# EAGLE design hematicComputer (EAGLE 9.6.2)
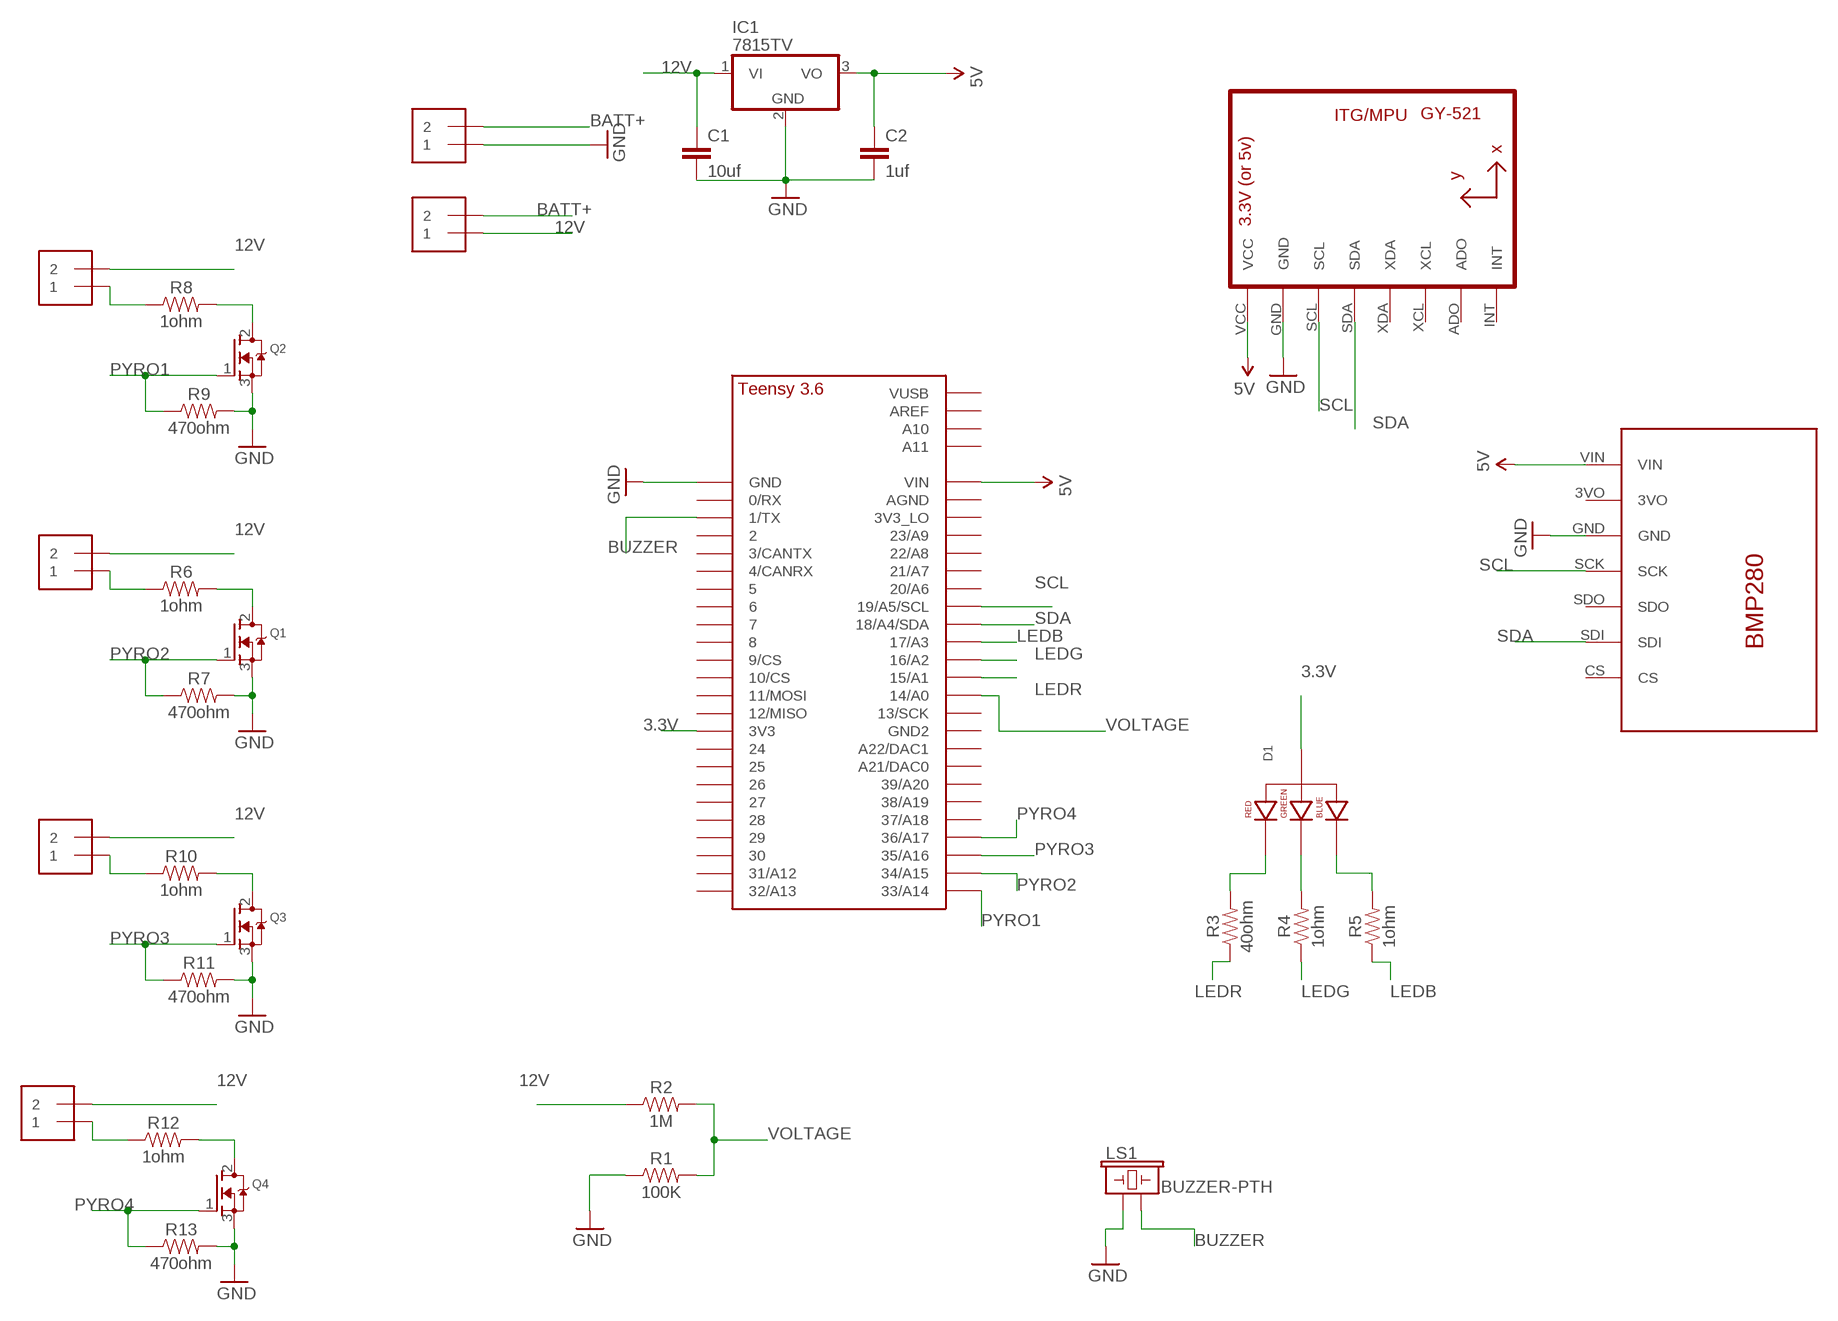
[diagram p0: schematic, sheet 1]

## Parts
C1  10uf  22PF-PTH-2.54MM-200V-5%  [CAP-PTH-2.54]
C2  1uf  22PF-PTH-2.54MM-200V-5%  [CAP-PTH-2.54]
D1  LED-RGB-CA-THRUCLEAR  [LED-RGB-THRU]
IC1  7815TV  [TO220V]
J1  1X2-3.5MM  [1X2-3.5MM]
J2  1X2-3.5MM  [1X2-3.5MM]
J3  1X2-3.5MM  [1X2-3.5MM]
J4  1X2-3.5MM  [1X2-3.5MM]
J5  1X2-3.5MM  [1X2-3.5MM]
J6  1X2-3.5MM  [1X2-3.5MM]
LS1  BUZZER-PTH  [BUZZER-12MM]
Q1  MOSFET-NGDS_TO220V  [TO220V]
Q2  MOSFET-NGDS_TO220V  [TO220V]
Q3  MOSFET-NGDS_TO220V  [TO220V]
Q4  MOSFET-NGDS_TO220V  [TO220V]
R1  100K  10KOHM-HORIZ-1/4W-1%  [AXIAL-0.3]
R2  1M  10KOHM-HORIZ-1/4W-1%  [AXIAL-0.3]
R3  40ohm  10KOHM-HORIZ-1/4W-1%  [AXIAL-0.3]
R4  1ohm  10KOHM-HORIZ-1/4W-1%  [AXIAL-0.3]
R5  1ohm  10KOHM-HORIZ-1/4W-1%  [AXIAL-0.3]
R6  1ohm  10KOHM-HORIZ-1/4W-1%  [AXIAL-0.3]
R7  470ohm  10KOHM-HORIZ-1/4W-1%  [AXIAL-0.3]
R8  1ohm  10KOHM-HORIZ-1/4W-1%  [AXIAL-0.3]
R9  470ohm  10KOHM-HORIZ-1/4W-1%  [AXIAL-0.3]
R10  1ohm  10KOHM-HORIZ-1/4W-1%  [AXIAL-0.3]
R11  470ohm  10KOHM-HORIZ-1/4W-1%  [AXIAL-0.3]
R12  1ohm  10KOHM-HORIZ-1/4W-1%  [AXIAL-0.3]
R13  470ohm  10KOHM-HORIZ-1/4W-1%  [AXIAL-0.3]
U1  GY-521MPU6050  [GY-521]
U$1  TEENSY_3.5/3.6_BASIC  [TEENSY_3.5/3.6_BASIC]
U$2  BMP280  [BMP280]

## Nets
3.3V: D1.2(ANODE) U$1.3V3
5V: C2.1 IC1.3(VO) U1.VCC U$1.VIN U$2.VIN
12V: C1.1 IC1.1(VI) J2.1 J3.2 J4.2 J5.2 J6.2 R2.P$1
BATT+: J1.2 J2.2
BUZZER: LS1.- U$1.1/TX
GND: C1.2 C2.2 IC1.2(GND) J1.1 LS1.+ Q1.3(S) Q2.3(S) Q3.3(S) Q4.3(S) R1.P$1 R7.P$2 R9.P$2 R11.P$2 R13.P$2 U1.GND U$1.GND U$2.GND
LEDB: R5.P$1 U$1.17/A3
LEDG: R4.P$1 U$1.16/A2
LEDR: R3.P$1 U$1.15/A1
N$1: D1.1(RED_CATHODE) R3.P$2
N$2: D1.3(GREEN_CATHODE) R4.P$2
N$3: D1.4(BLUE_CATHODE) R5.P$2
N$4: Q1.2(D) R6.P$2
N$5: J6.1 R6.P$1
N$7: J3.1 R8.P$1
N$8: Q2.2(D) R8.P$2
N$10: J4.1 R10.P$1
N$11: Q3.2(D) R10.P$2
N$13: J5.1 R12.P$1
N$14: Q4.2(D) R12.P$2
PYRO1: Q2.1(G) R9.P$1 U$1.33/A14
PYRO2: Q1.1(G) R7.P$1 U$1.34/A15
PYRO3: Q3.1(G) R11.P$1 U$1.35/A16
PYRO4: Q4.1(G) R13.P$1 U$1.36/A17
SCL: U1.SCL U$1.19/A5/SCL U$2.SCK
SDA: U1.SDA U$1.18/A4/SDA U$2.SDI
VOLTAGE: R1.P$2 R2.P$2 U$1.14/A0
Unconnected: U1.ADO U1.INT U1.XCL U1.XDA U$1.0/RX U$1.2 U$1.3/CANTX U$1.3V3_LO U$1.4/CANRX U$1.5 U$1.6 U$1.7 U$1.8 U$1.9/CS U$1.10/CS U$1.11/MOSI U$1.12/MISO U$1.13/SCK U$1.20/A6 U$1.21/A7 U$1.21/DAC0(A21/DAC0) U$1.22/A8 U$1.23/A9 U$1.24 U$1.25 U$1.26 U$1.27 U$1.28 U$1.29 U$1.30 U$1.31/A12 U$1.32/A13 U$1.37/A18 U$1.38/A19 U$1.39/A20 U$1.A10 U$1.A11 U$1.A22/DAC1 U$1.AGND U$1.AREF U$1.GND2 U$1.VUSB U$2.3VO U$2.CS U$2.SDO

## Library data of the parts
C1 C2 = SparkFun-Capacitors:22PF: 22pF ceramic capacitors A capacitor is a passive two-terminal electrical component used to store electrical energy temporarily in an electric field.; PROD_ID: CAP-09128; VALUE: 22pF
D1 = SparkFun-LED:LED-RGB-CA-THRU: RGB Through-hole common anode SparkFun store front COM-10821 (diffuse) COM-10820 (clear); PROD_ID: DIO-10631
IC1 = linear:78*: Positive VOLTAGE REGULATOR Source: http://cache.national.com/ds/LM/LM78L05.pdf http://www.fairchildsemi.com/ds/LM/LM7805.pdf
J1-J6 = adafruit:1X2: 3.5mm Terminal block http://www.ladyada.net/library/pcb/eaglelibrary.html
LS1 = SparkFun-Electromechanical:BUZZER: Buzzer Small round buzzers that operate around the audible 2kHz range. You can use these as speakers to create simple music or user interfaces. Variant Overview: PTH - Mini Speaker - PC Mount 12mm 2.048kHz <https://www.sparkfun.com/products/7950> PTH_KIT - Mini Speaker - PC Mount 12mm 2.048kHz <https://www.sparkfun.com/products/7950> KIT simplifies soldering by adding stop mask to one side of the pads. PTH_NO_SILK - Mini Speaker - PC Mount 12mm 2.048kHz <https://www.sparkfun.com/products/7950> No silkscreen indicator of buzzer outline. PTH_KIT_NO_SILK - Mini Speaker - PC Mount 12mm 2.048kHz <https://www.sparkfun.com/products/7950> KIT package w/o silkscreen SMD - Buzzer Audio Magnetic (CCV-084B16) SMD buzzer used on, e.g. the LilyPad Buzzer <https://www.sparkfun.com/products/8463> and RFID USB Reader <https://www.sparkfun.com/products/9963>. SMD_KIT - Buzzer Audio Magnetic (CCV-084B16) SMD Buzzer with elongated pins to make soldering easier. Used on the SparkFun Simon Says - Surface Mount Soldering Kit <https://www.sparkfun.com/products/10935>. SMD-SQUARE - Buzzer Audio Magnetic (COMP-15701) SMT square buzzer with one chamfered corner.; PROD_ID: COMP-08253; SF_SKU: COM-07950
Q1-Q4 = adafruit:MOSFET-N: N-Channel Mosfet 2N7002E - 60V 260mA SOT23 [Digikey: 2N7002ET1GOSTR-ND] - REEL BSH103 - 30V 850mA SOT23 [Digikey: 568-5013-1-ND]
R1-R13 = SparkFun-Resistors:10KOHM: 10kΩ resistor A resistor is a passive two-terminal electrical component that implements electrical resistance as a circuit element. Resistors act to reduce current flow, and, at the same time, act to lower voltage levels within circuits. - Wikipedia; PROD_ID: RES-12183; VALUE: 10k
U1 = gy-521:GY-521
U$1 = Teensy356:TEENSY_3.5/3.6_BASIC
U$2 = BMP280:BMP280

## Board
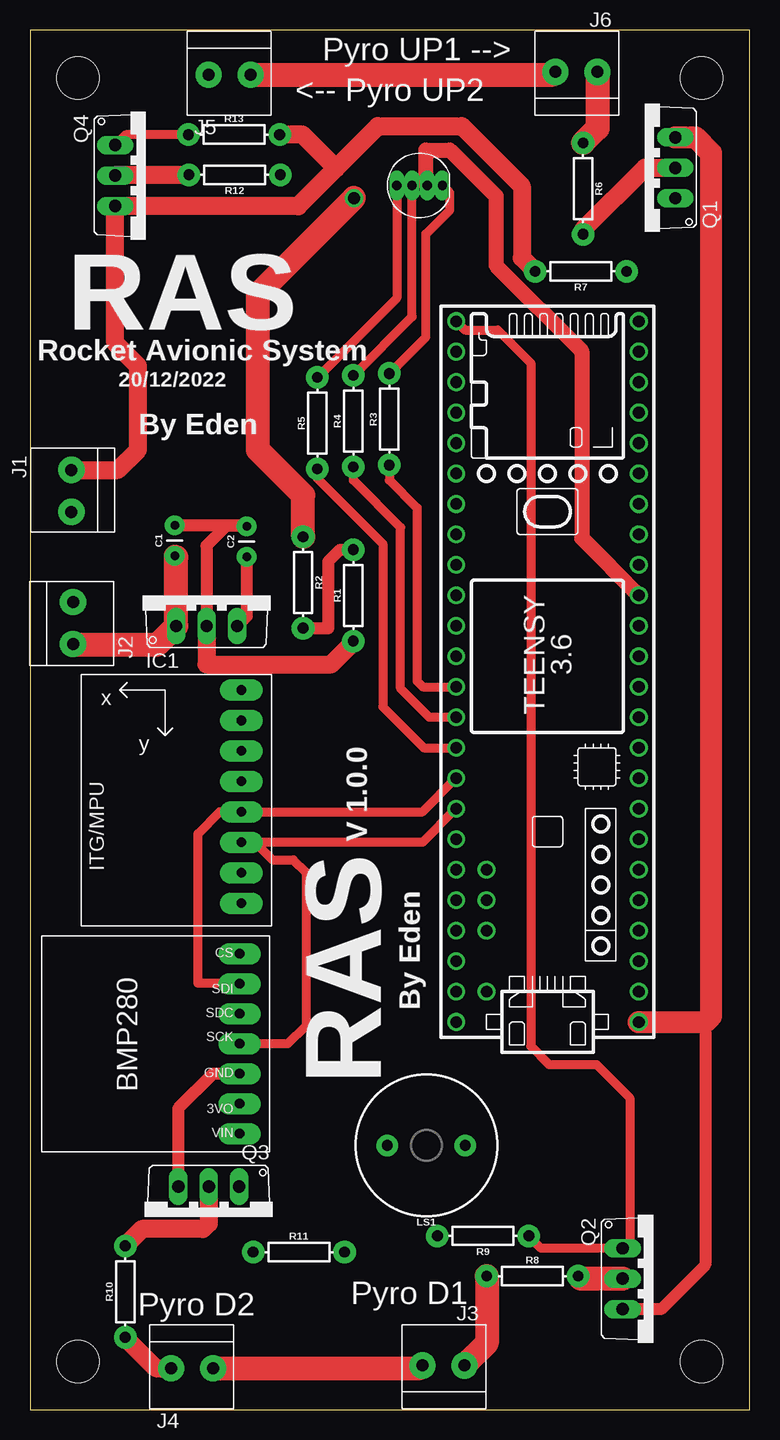
[diagram p1: board, top side]
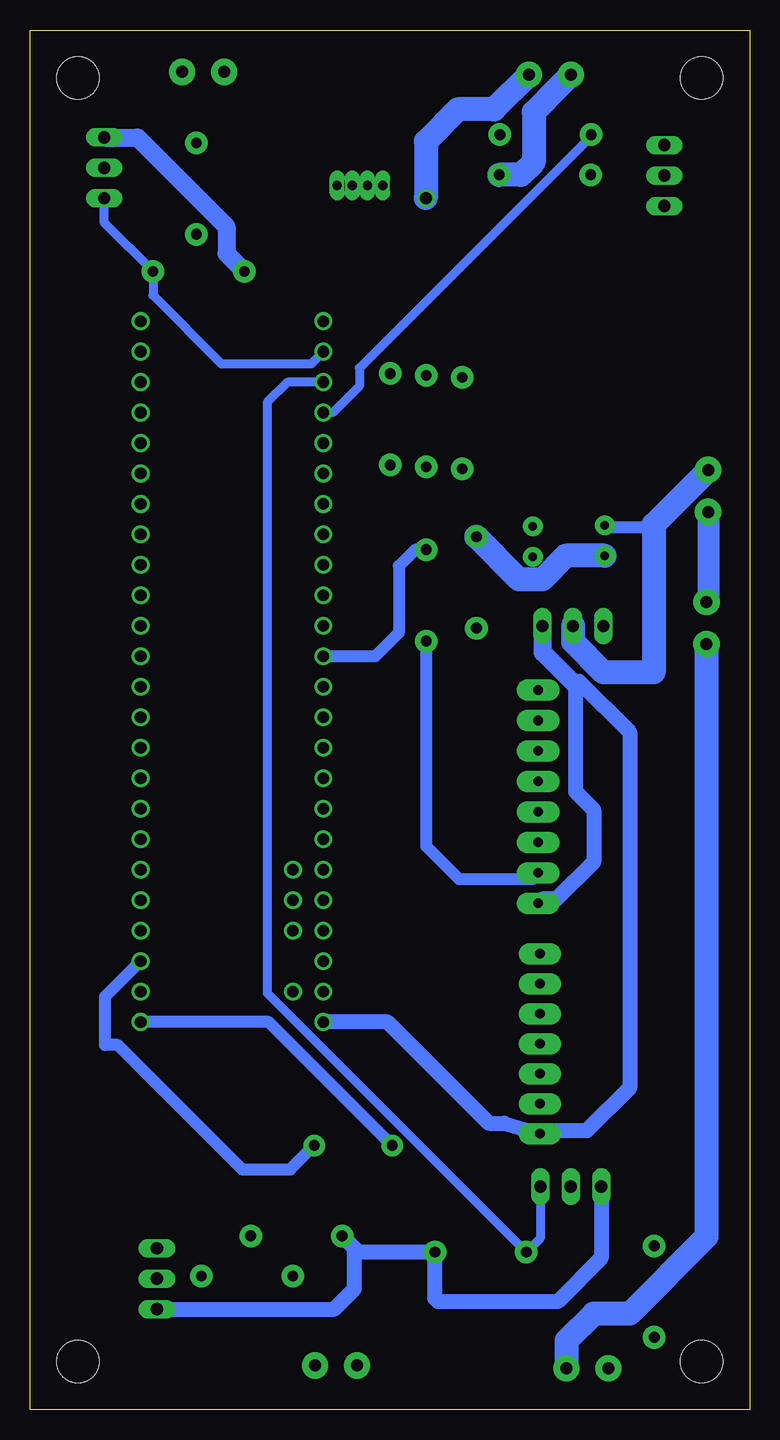
[diagram p2: board, bottom side, seen from below]

Size 60 x 115 mm. Coordinates in mm from the lower left corner, seen from the top.
Outline: 0,0 60,0 60,115 0,115 0,0
Copper layers (1*16): Top 0.035mm / dielectric 1.5mm / Bottom 0.035mm
Design rules "default": minimum track width 6mil, minimum drill 0.35mm, track to track 6mil, track to pad 6mil, pad to pad 6mil, via to via 6mil, smd to smd 6mil, copper to edge 40mil, drill to drill 6mil, minimum pad ring 10mil, minimum via ring 8mil, stop-mask expansion 4mil, vias tented up to drill 0mil, thermal gap 10mil
Holes 3.5 mm at 4,4 56,4 56,111 4,111

### Footprints (pad centres in the part's own frame; a part is rotated, then mirrored left to right if it is on the bottom)
CAP-PTH-2.54 = drill 0.7 pad 1.651: 1 -1.27,0; 2 1.27,0
LED-RGB-THRU = drill 0.762 pad 0.889 long: 1 1.905,0; 2 0.635,0; 3 -0.635,0; 4 -1.905,0
TO220V = drill 1.016 long: 1 -2.54,-2.54; 2 0,-2.54; 3 2.54,-2.54
1X2-3.5MM = drill 1 pad 2.184: 1 1.8,0; 2 -1.7,0
BUZZER-12MM = drill 0.9 pad 1.778: + 3.25,0; - -3.25,0
AXIAL-0.3 = drill 0.9 pad 1.88: P$1 -3.81,0; P$2 3.81,0
GY-521 = drill 0.8 pad 1.778 long: ADO -8.89,-6.35; GND -8.89,6.35; INT -8.89,-8.89; SCL -8.89,3.81; SDA -8.89,1.27; VCC -8.89,8.89; XCL -8.89,-3.81; XDA -8.89,-1.27
TEENSY_3.5/3.6_BASIC = drill 0.965: 0/RX -25.4,-7.62; 1/TX -22.86,-7.62; 2 -20.32,-7.62; 3/CANTX -17.78,-7.62; 3V3 7.62,-7.62; 3V3_LO -22.86,7.62; 4/CANRX -15.24,-7.62; 5 -12.7,-7.62; 6 -10.16,-7.62; 7 -7.62,-7.62; 8 -5.08,-7.62; 9/CS -2.54,-7.62; 10/CS 0,-7.62; 11/MOSI 2.54,-7.62; 12/MISO 5.08,-7.62; 13/SCK 5.08,7.62; 14/A0 2.54,7.62; 15/A1 0,7.62; 16/A2 -2.54,7.62; 17/A3 -5.08,7.62; 18/A4/SDA -7.62,7.62; 19/A5/SCL -10.16,7.62; 20/A6 -12.7,7.62; 21/A7 -15.24,7.62; 21/DAC0 12.7,7.62; 22/A8 -17.78,7.62; 23/A9 -20.32,7.62; 24 10.16,-7.62; 25 12.7,-7.62; 26 15.24,-7.62; 27 17.78,-7.62; 28 20.32,-7.62; 29 22.86,-7.62; 30 25.4,-7.62; 31/A12 27.94,-7.62; 32/A13 30.48,-7.62; 33/A14 30.48,7.62; 34/A15 27.94,7.62; 35/A16 25.4,7.62; 36/A17 22.86,7.62; 37/A18 20.32,7.62; 38/A19 17.78,7.62; 39/A20 15.24,7.62; A10 -17.78,5.08; A11 -15.24,5.08; A22/DAC1 10.16,7.62; AGND -25.4,7.62; AREF -20.32,5.08; GND -27.94,-7.62; GND2 7.62,7.62; VIN -27.94,7.62; VUSB -25.4,5.08
BMP280 = drill 0.8 pad 1.778 long: 3VO 4,2.5; CS 16.5,2.5; GND 6.5,2.5; SCK 9,2.5; SDI 14,2.5; SDO 11.5,2.5; VIN 1.5,2.5

### Placement (x,y rotation side)
C1  12.07,72.44 90 top
C2  18.07,72.36 90 top
D1  32.49,102.04 0 top
IC1  14.73,67.86 0 top
J1  3.46,76.53 90 top
J2  3.59,65.61 270 top
J3  34.44,3.67 0 top
J4  13.56,3.44 180 top
J5  16.69,111.28 180 top
J6  45.52,111.51 0 top
LS1  33.05,22.01 180 top
Q1  51.27,103.51 90 top
Q2  51.96,10.91 270 top
Q3  14.91,16.05 180 top
Q4  9.65,102.87 270 top
R1  26.96,67.87 90 top
R2  22.77,68.95 270 top
R3  29.96,82.55 90 top
R4  26.96,82.39 90 top
R5  23.96,82.23 90 top
R6  46.12,101.78 270 top
R7  45.94,94.88 180 top
R8  41.9,11.12 0 top
R9  37.78,14.47 180 top
R10  7.95,9.83 90 top
R11  22.42,13.12 0 top
R12  17.06,102.93 180 top
R13  17.01,106.28 0 top
U1  8.73,51.09 180 top
U$1  43.15,60.25 90 top
U$2  19.98,21.49 90 top

### Tracks (layer width: path | path; a pad name or v marks a point on that pad's centre or on a via)
3.3V
  Top 1: D1.2 33,102.17
  Top 1.25: 33,102.17 33,105 35.02,105 38.86,101.16 38.86,95.37 46,88.23 46,72.64 U$1.3V3
5V
  Top 1: C2.1 18.07,66.12 IC1.3
  Bottom 1.25: IC1.3 17.27,63.14 | 14.49,60.36 14.49,51.49 13,50 13,45.64 16.09,42.55 17.27,42.55 U1.VCC | 17.27,63.08 14.89,60.7 14.22,60.7 10,56.48 10,26.81 13.54,23.26 17.21,23.26 U$2.VIN 20.44,23.86 21.73,23.86 30.18,32.3 U$1.VIN
  Bottom 1.5: 17.27,63.14 14.49,60.36 | IC1.3 17.27,63.08
12V  (via drill 1)
  Top 1.82: 3.66,63.73 J2.1 | 12.19,71.05 C1.1 | 43.6,111.28 J6.2 | 32.51,3.44 J3.2
  Top 2: 3.66,63.73 10.6,63.73 IC1.1 12.19,71.05 | J5.2 43.6,111.28 | J4.2 32.51,3.44 | R2.P$1 22.77,76.23 19,80 19,93 v27,101
  Bottom 2: C1.1 15.32,71.17 17.29,69.2 19.21,69.2 R2.P$1 | J5.2 21.29,108.38 24.33,108.38 27,105.71 v27,101 | J2.1 3.59,14.41 10,8 13,8 15.26,5.74 J4.2
BATT+
  Bottom 1.82: J1.2 3.46,67.44 J2.2
BUZZER
  Bottom 1: LS1.- 38.3,20.01 42.3,20.01 52.67,30.39 53.77,30.39 53.77,34.38 U$1.1/TX
GND
  Top 1: Q2.3 52.64,8.37 56.3,12.03 56.3,32.3 | IC1.2 14.72,72.01 16.35,73.63 C2.2 17.99,73.71 C1.2 | 26.96,63.96 R1.P$1 | U$2.GND 15.27,27.99 12.37,25.09 Q3.3
  Top 1.5: J1.1 7.33,78.33 9,80 9,87 7.11,88.89 Q4.3 7.13,100.31 22.36,100.31 25.52,103.47 25.5,103.5 | 25.5,103.5 22.72,106.28 R13.P$2 | 25.5,103.5 29,107 36,107 41,102 41,96.01 R7.P$2 | IC1.2 14.73,62.11 25.11,62.11 26.96,63.96
  Top 1.82: Q1.3 55.5,106.05 56.79,104.76 56.79,32.79 56.3,32.3 U$1.GND
  Bottom 1: LS1.+ 40.09,32.3 U$1.GND | 26,9 26.23,9.23 | 7.55,72.77 8.37,73.58 11.94,73.58 C1.2 | R1.P$1 26.96,46.96 24.22,44.22 18.14,44.22 U1.GND
  Bottom 1.23: 32.62,13.12 R9.P$2
  Bottom 1.25: Q2.3 34.63,8.37 32.97,10.03 32.97,13.47 R9.P$2 | 32.62,13.12 R11.P$2 26.23,9.23 | Q3.3 12.37,12.63 16,9 26,9
  Bottom 1.5: R7.P$2 43.62,96.37 43.62,98.61 51.04,106.03 53.79,106.03 Q1.3
  Bottom 2: J1.1 8,73.79 8,61.45 12.17,61.45 14.73,64.01 IC1.2
LEDB
  Top 0.75: R5.P$1 23.96,77.61 29.43,72.15 29.43,58.58 32.84,55.16 U$1.17/A3
LEDG
  Top 0.75: U$1.16/A2 33.3,57.7 30.9,60.1 30.9,73.52 26.96,77.47 R4.P$1
LEDR
  Top 0.75: R3.P$1 29.96,77.46 32.27,75.15 32.27,60.73 32.76,60.24 U$1.15/A1
N$1
  Top 0.75: R3.P$2 33,89.4 33,98 35,100 35,101.44 D1.1
N$2
  Top 0.75: R4.P$2 31.86,91.09 D1.3
N$3
  Top 0.75: D1.4 30.59,92.67 R5.P$2
N$4
  Top 1.5: R6.P$2 46.12,98.34 51.31,103.53 51.33,103.51 Q1.2
N$5
  Top 2: J6.1 47.32,106.79 R6.P$1
N$7
  Top 2: R8.P$1 38.09,5.52 J3.1
N$8
  Top 1.5: 45.92,10.91 R8.P$2
  Top 2: Q2.2 45.92,10.91
N$10
  Top 1.5: R10.P$1 7.95,5.98 10.49,3.44 J4.1
N$11
  Top 1.5: Q3.2 14.91,15.52 14.44,15.04 9.35,15.04 R10.P$2
N$13
  Bottom 1.5: 16.87,109.3 16.87,109.29
  Bottom 2: J5.1 16.87,109.3 | 16.87,109.29 18,108.16 18,104 19.07,102.93 R12.P$1
N$14
  Top 1.5: Q4.2 7.17,102.93 R12.P$2
PYRO1
  Top 0.75: R9.P$1 42.62,13.45 Q2.1 50,14.03 50,26 47.23,28.77 43.29,28.77 41.76,30.29 41.76,87.24 39,90 36.26,90 U$1.33/A14
PYRO2
  Bottom 0.75: Q1.1 53.8,98.94 R7.P$1 49.75,92.88 44.05,87.19 36.53,87.19 U$1.34/A15
PYRO3
  Bottom 0.75: U$1.35/A16 38.53,85.64 40.21,83.96 40.21,34.72 R11.P$1 17.45,14.28 Q3.1
PYRO4
  Top 0.75: R13.P$1 13.19,106.27 7.97,106.27 Q4.1
  Bottom 0.75: R13.P$1 13.2,106.15 32.53,86.82 32.53,85.32 34.74,83.11 U$1.36/A17
SCL
  Top 0.75: U$1.19/A5/SCL 32.73,47.28 U1.SCL 18.77,47.28 20.22,45.83 21.95,45.83 23,44.78 23,32 21.49,30.49 U$2.SCK
SDA
  Top 0.75: U$1.18/A4/SDA 32.73,49.82 U1.SDA 15.82,49.82 14,48 14,35.53 17.46,35.53 U$2.SDI
VOLTAGE
  Top 1: R2.P$2 24.86,65.14 24.86,70.68 25.86,71.68 R1.P$2
  Bottom 1: R1.P$2 27.87,71.68 29.24,70.31 29.24,64.76 31.21,62.78 U$1.14/A0

### Text on the board
tNames: Pyro UP1 --> | <-- Pyro UP2 | RAS | Rocket Avionic System | 20/12/2022 | By Eden | V 1.0.0 | RAS | By Eden | Pyro D1 | Pyro D2